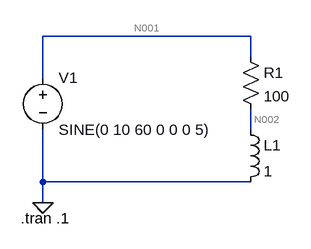
[diagram p0: schematic Draft2.asc]
Draft2.asc, the LTspice schematic file:
Version 4
SHEET 1 880 680
WIRE 208 64 -112 64
WIRE 208 96 208 64
WIRE -112 128 -112 64
WIRE 208 208 208 176
WIRE -112 288 -112 208
WIRE 208 288 -112 288
WIRE -112 320 -112 288
FLAG -112 320 0
SYMBOL voltage -112 112 R0
WINDOW 123 0 0 Left 2
WINDOW 39 0 0 Left 2
SYMATTR InstName V1
SYMATTR Value SINE(0 10 60 0 0 0 5)
SYMBOL res 192 80 R0
SYMATTR InstName R1
SYMATTR Value 100
SYMBOL ind 192 192 R0
SYMATTR InstName L1
SYMATTR Value 1
SYMATTR SpiceLine Rser=0
TEXT -146 344 Left 2 !.tran .1

The netlist it stands for:
* Draft2.asc
V1 N001 0 SINE(0 10 60 0 0 0 5)
R1 N001 N002 100
L1 N002 0 1 Rser=0
.tran .1
.backanno
.end

* Results of the author's LTspice run, read from the files saved beside the schematic
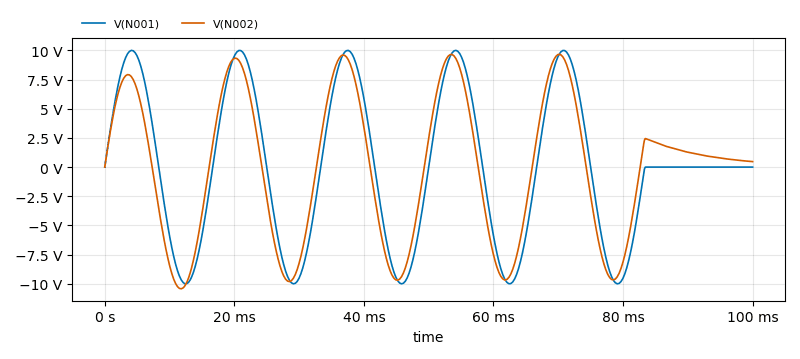
[diagram p1: Transient Analysis of Draft2.asc, plotted from the saved traces]
* Transient Analysis, 1 run:
*   V(N001): min -9.997 V, max 9.996 V, average -108 µV, rms 6.453 V, last 0 V
*   V(N002): min -10.42 V, max 9.66 V, average -45.35 mV, rms 6.188 V, last 468 mV